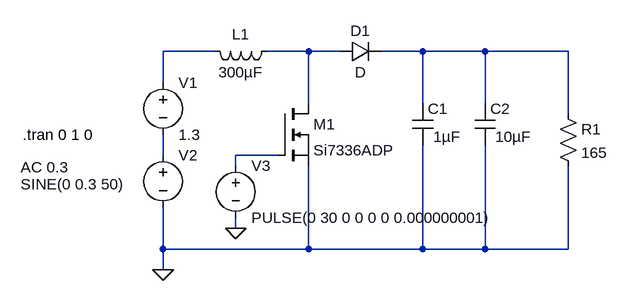
[diagram p0: schematic GPS_Power Supply Simulation.asc]
GPS_Power Supply Simulation.asc, the LTspice schematic file:
Version 4
SHEET 1 880 680
WIRE 128 112 48 112
WIRE 272 112 208 112
WIRE 320 112 272 112
WIRE 448 112 384 112
WIRE 544 112 448 112
WIRE 672 112 544 112
WIRE 48 160 48 112
WIRE 272 192 272 112
WIRE 448 192 448 112
WIRE 544 192 544 112
WIRE 672 208 672 112
WIRE 48 272 48 240
WIRE 224 272 160 272
WIRE 160 288 160 272
WIRE 160 384 160 368
WIRE 48 416 48 352
WIRE 272 416 272 288
WIRE 272 416 48 416
WIRE 448 416 448 256
WIRE 448 416 272 416
WIRE 544 416 544 256
WIRE 544 416 448 416
WIRE 672 416 672 288
WIRE 672 416 544 416
WIRE 48 448 48 416
FLAG 48 448 0
FLAG 160 384 0
SYMBOL voltage 48 144 R0
WINDOW 123 0 0 Left 0
WINDOW 39 0 0 Left 0
SYMATTR InstName V1
SYMATTR Value 1.3
SYMBOL voltage 48 256 R0
WINDOW 3 -219 60 Left 2
WINDOW 123 -219 34 Left 2
WINDOW 39 0 0 Left 0
SYMATTR Value SINE(0 0.3 50)
SYMATTR Value2 AC 0.3
SYMATTR InstName V2
SYMBOL nmos 224 192 R0
SYMATTR InstName M1
SYMATTR Value Si7336ADP
SYMBOL diode 320 128 R270
WINDOW 0 32 32 VTop 2
WINDOW 3 0 32 VBottom 2
SYMATTR InstName D1
SYMBOL ind 224 96 R90
WINDOW 0 5 56 VBottom 2
WINDOW 3 32 56 VTop 2
SYMATTR InstName L1
SYMATTR Value 300µF
SYMBOL cap 528 192 R0
WINDOW 3 32 51 Left 2
SYMATTR InstName C2
SYMATTR Value 10µF
SYMBOL res 656 192 R0
SYMATTR InstName R1
SYMATTR Value 165
SYMBOL voltage 160 272 R0
WINDOW 123 0 0 Left 0
WINDOW 39 0 0 Left 0
SYMATTR InstName V3
SYMATTR Value PULSE(0 30 0 0 0 0 0.000000001)
SYMBOL cap 432 192 R0
WINDOW 3 32 51 Left 2
SYMATTR InstName C1
SYMATTR Value 1µF
TEXT -168 240 Left 2 !.tran 0 1 0

The netlist it stands for:
* GPS_Power Supply Simulation.asc
V1 N001 N004 1.3
V2 N004 0 SINE(0 0.3 50) AC 0.3
M1 N002 N005 0 0 Si7336ADP
D1 N002 N003 D
L1 N002 N001 300µF
C2 N003 0 10µF
R1 N003 0 165
V3 N005 0 PULSE(0 30 0 0 0 0 0.000000001)
C1 N003 0 1µF
.model D D
.lib standard.dio
.model NMOS NMOS
.model PMOS PMOS
.lib standard.mos
.tran 0 1 0
.backanno
.end